# Altium project running car pcb.PrjPcb
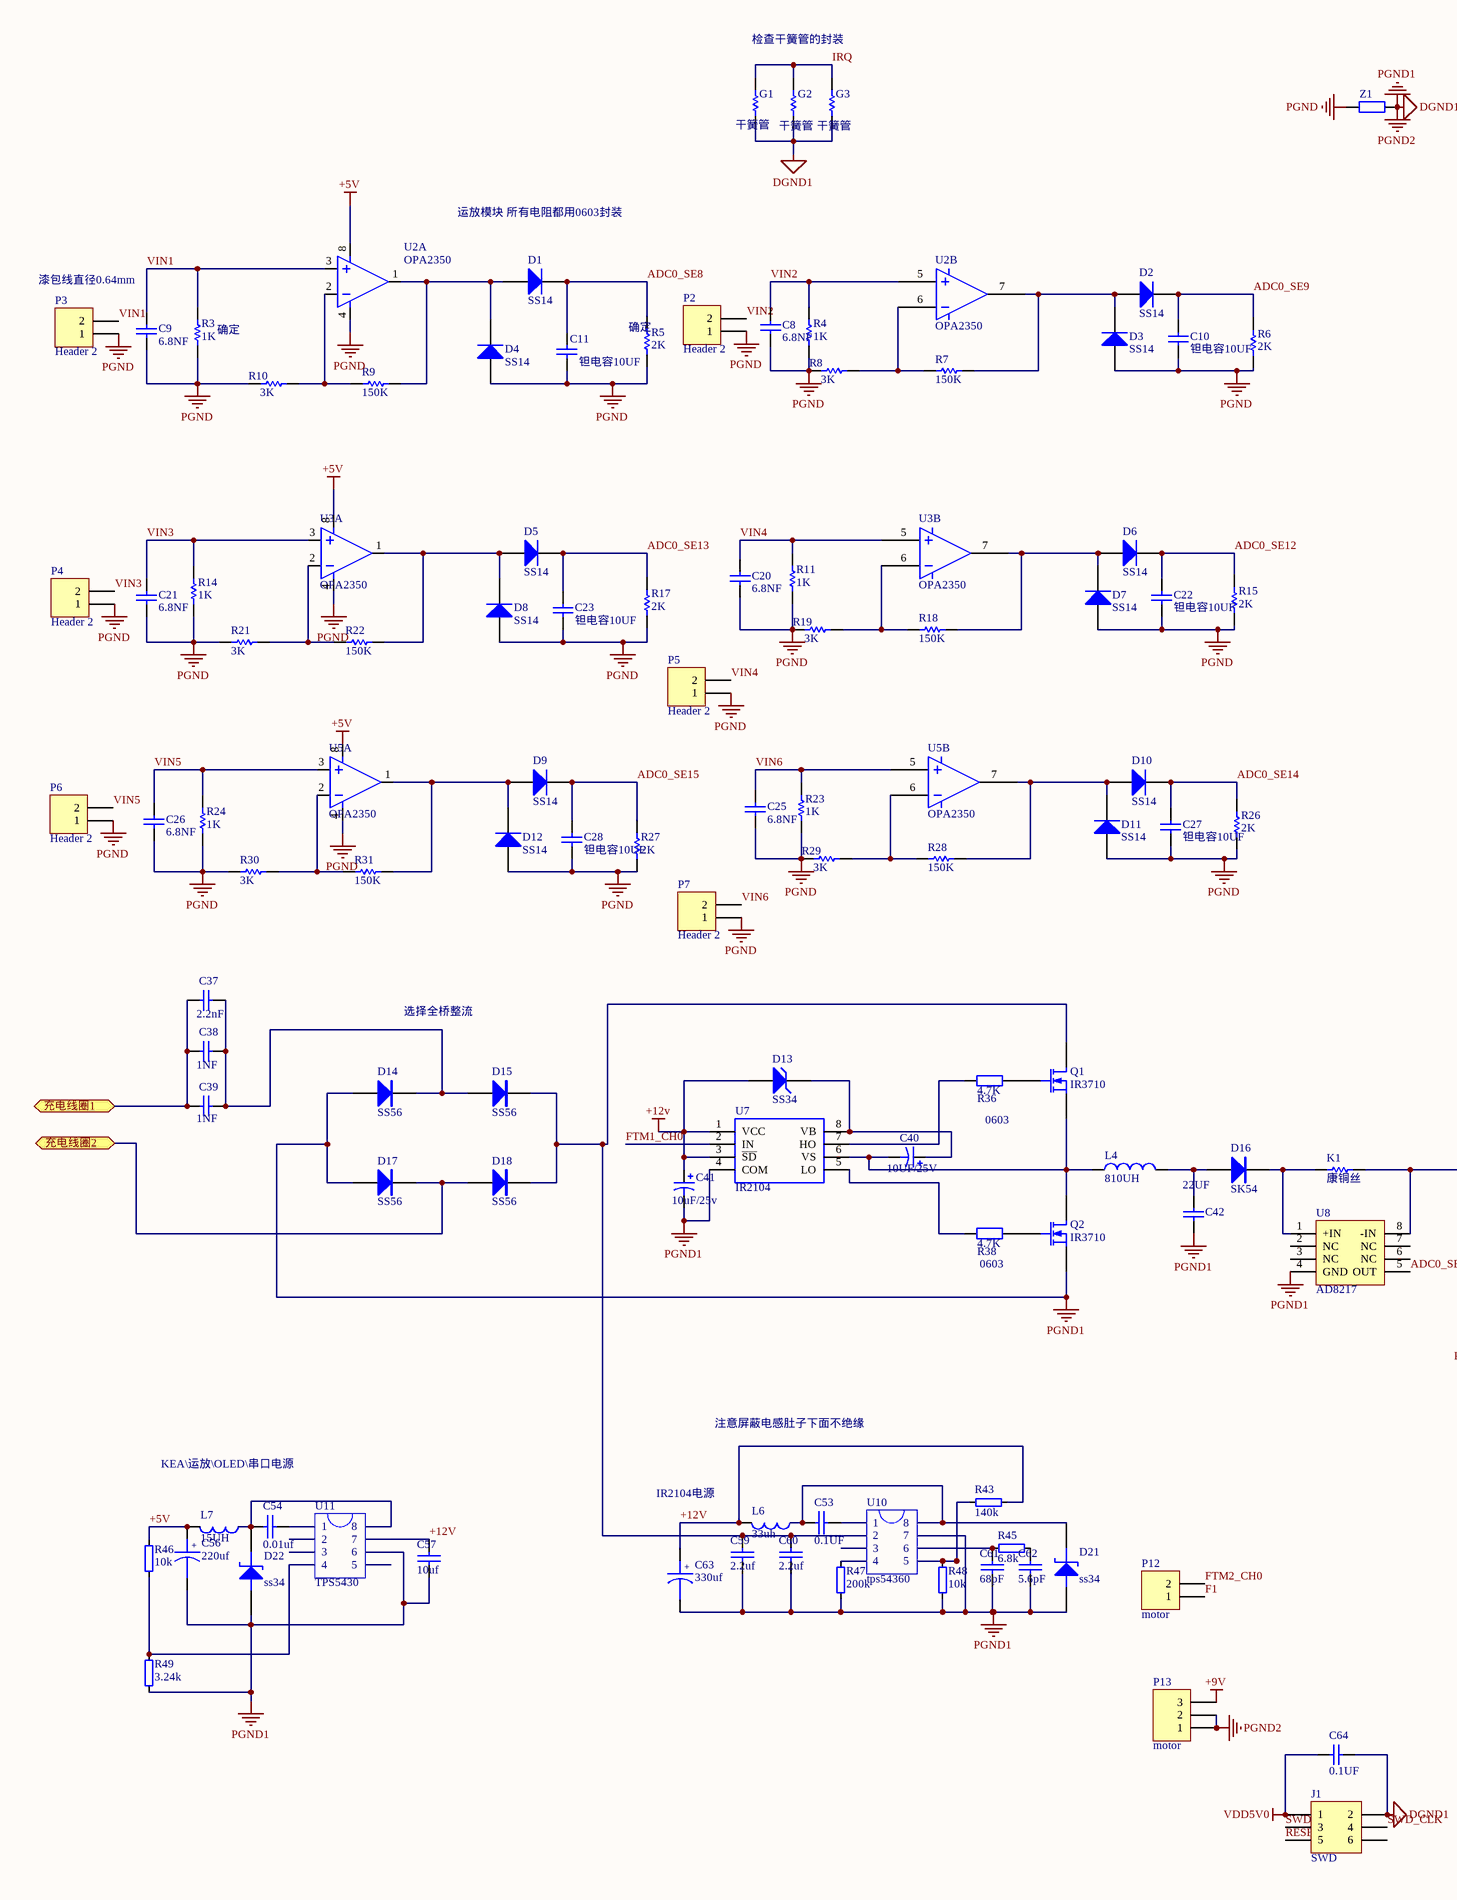
[diagram p0: running car pcb.SchDoc, left]
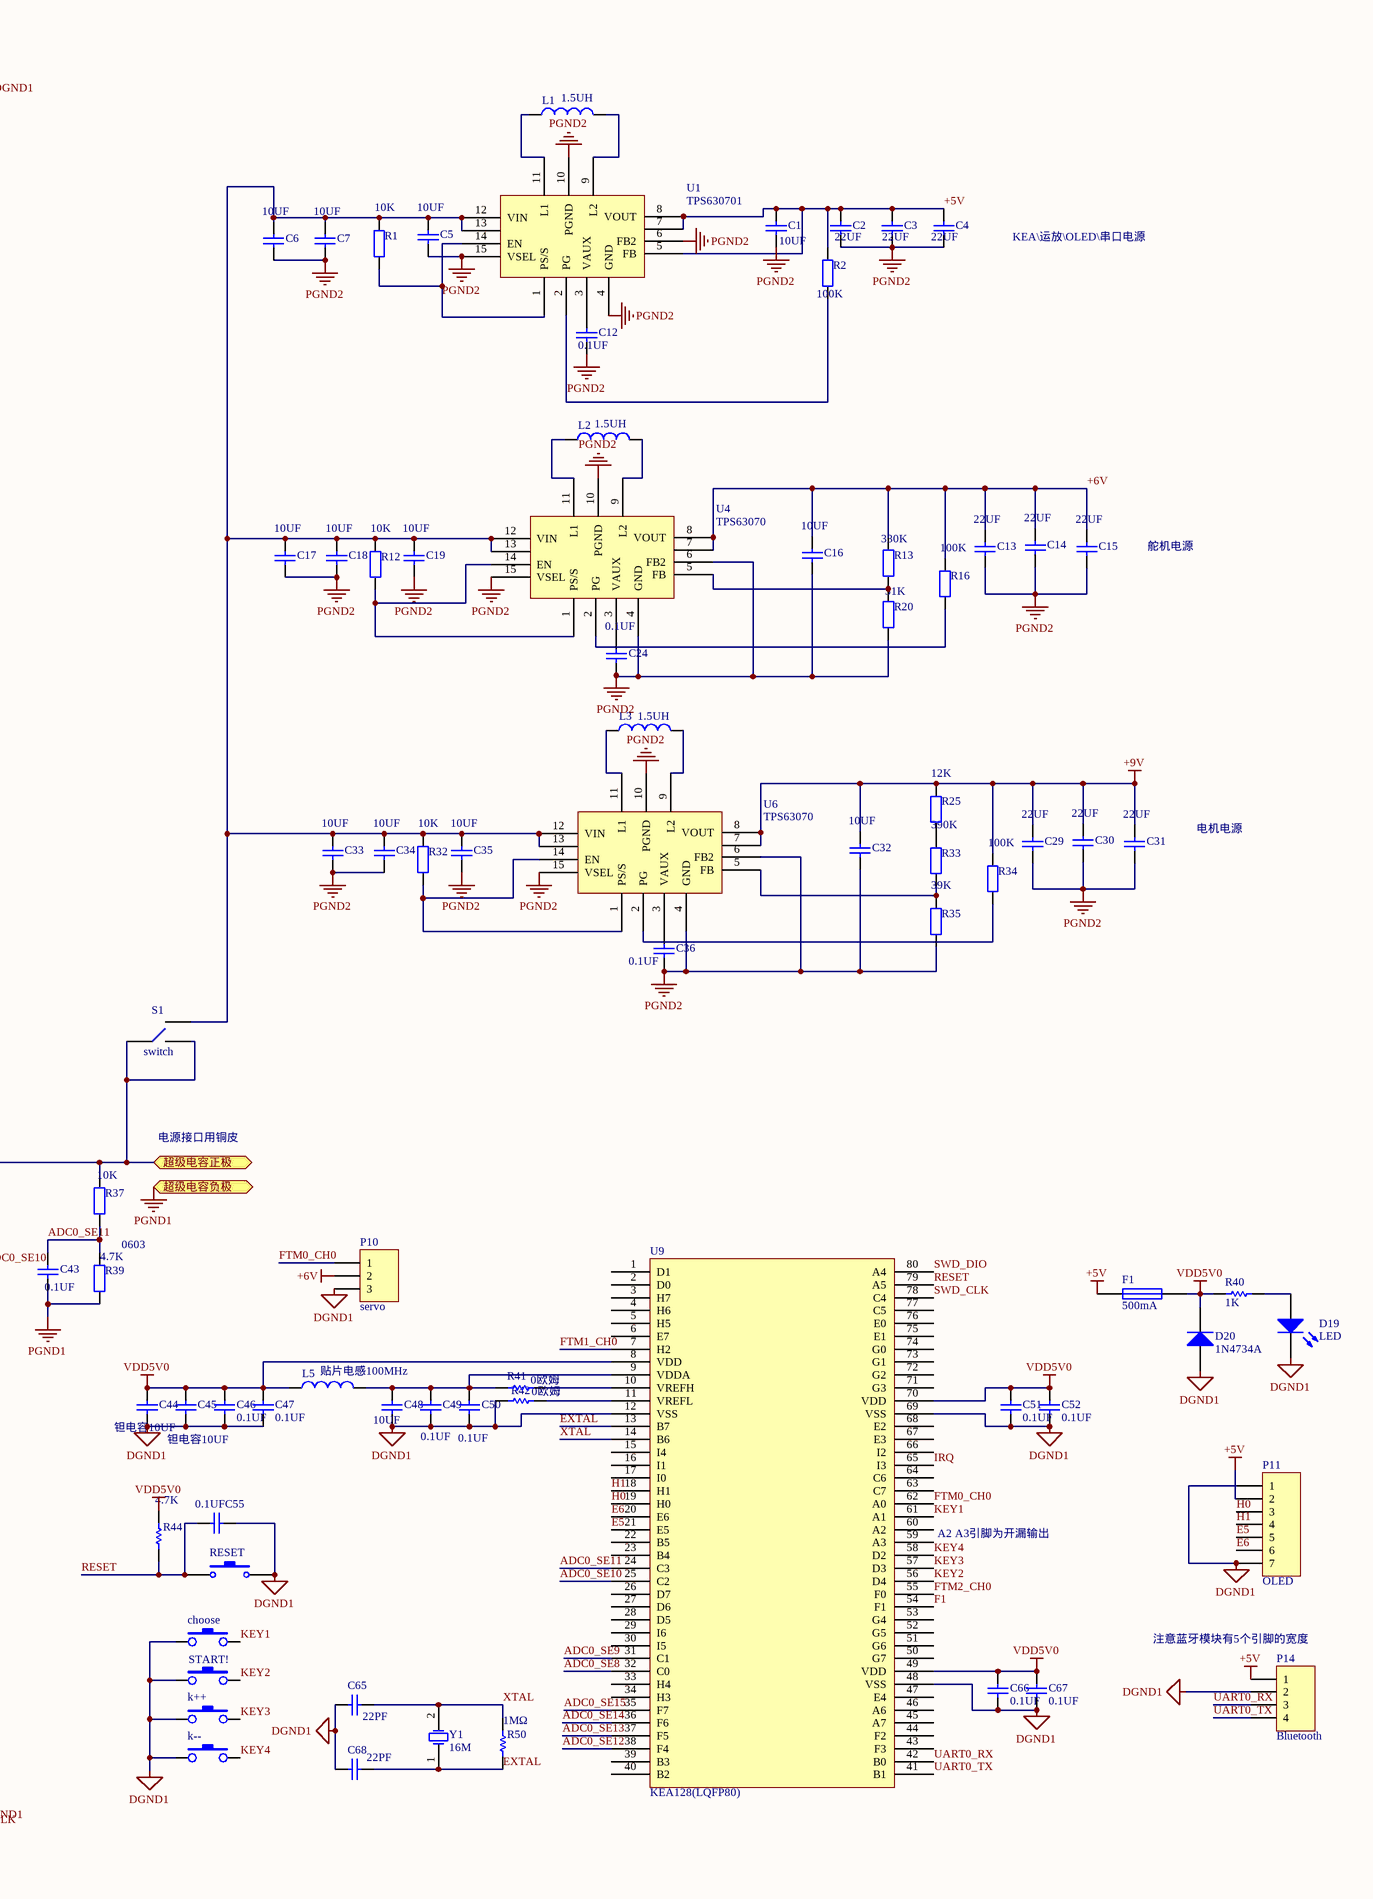
[diagram p1: running car pcb.SchDoc, right]
1 sheet, 184 parts. Net scope: flat (ports and power ports of the same name join across sheets).
Board file: running car pcb.PcbDoc

## Sheet running car pcb.SchDoc
size A2

### Parts
C1  10UF  [C0805]
C2  22UF  [C0805]
C3  22UF  [C0805]
C4  22UF  [C0805]
C5  10UF  [C0805]
C6  10UF  [C0805]
C7  10UF  [C0805]
C8  6.8NF  [6.8NF]
C9  6.8NF  [6.8NF]
C10  钽电容10UF  [106A]
C11  钽电容10UF  [106A]
C12  0.1UF  [1608[0603]]
C13  22UF  [C0805]
C14  22UF  [C0805]
C15  22UF  [C0805]
C16  10UF  [C0805]
C17  10UF  [C0805]
C18  10UF  [C0805]
C19  10UF  [C0805]
C20  6.8NF  [6.8NF]
C21  6.8NF  [6.8NF]
C22  钽电容10UF  [106A]
C23  钽电容10UF  [106A]
C24  0.1UF  [1608[0603]]
C25  6.8NF  [6.8NF]
C26  6.8NF  [6.8NF]
C27  钽电容10UF  [106A]
C28  钽电容10UF  [106A]
C29  22UF  [C0805]
C30  22UF  [C0805]
C31  22UF  [C0805]
C32  10UF  [C0805]
C33  10UF  [C0805]
C34  10UF  [C0805]
C35  10UF  [C0805]
C36  0.1UF  [1608[0603]]
C37  2.2nF  [C1206]
C38  1NF  [C1206]
C39  1NF  [C1206]
C40  10UF/25V  [CAP_3528]
C41  10UF/25V  [CAP_3528]
C42  22UF  [C0805]
C43  0.1UF  [1608[0603]]
C44  钽电容10UF  [106A]
C45  钽电容10UF  [106A]
C46  0.1UF  [1608[0603]]
C47  0.1UF  [1608[0603]]
C48  10UF  [C0805]
C49  0.1UF  [1608[0603]]
C50  0.1UF  [1608[0603]]
C51  0.1UF  [1608[0603]]
C52  0.1UF  [1608[0603]]
C53  0.1UF  [1608[0603]]
C54  0.01uf  [1608[0603]]
C55  0.1UF  [1608[0603]]
C56  220uf  [SMD-EC-F6.3]
C57  10uf  [C0805]
C59  2.2uf  [C0805]
C60  2.2uf  [C0805]
C61  68pF  [1608[0603]]
C62  5.6pF  [1608[0603]]
C63  330uf  [SMD-EC-F8]
C64  0.1UF  [1608[0603]]
C65  22PF  [1608[0603]]
C66  0.1UF  [1608[0603]]
C67  0.1UF  [1608[0603]]
C68  22PF  [1608[0603]]
choose  按键  [KEY2(TP_S)]  (value not drawn)
D1  SS14  [SS14]
D2  SS14  [SS14]
D3  SS14  [SS14]
D4  SS14  [SS14]
D5  SS14  [SS14]
D6  SS14  [ss14]
D7  SS14  [ss14]
D8  SS14  [SS14]
D9  SS14  [ss14]
D10  SS14  [ss14]
D11  SS14  [ss14]
D12  SS14  [ss14]
D13  SS34  [SS14]
D14  SS56  [SS14]
D15  SS56  [SS14]
D16  SK54  [SMB]
D17  SS56  [SS14]
D18  SS56  [SS14]
D19  LED  [0603D]
D20  1N4734A  [1N4734A]
D21  ss34  [SS14]
D22  ss34  [SS14]
F1  500mA  [F1]
G1  干簧管  [干簧管]
G2  干簧管  [干簧管]
G3  干簧管  [干簧管]
J1  SWD  [HDR2X3]
K1  康铜丝  [KTS]
k++  按键  [KEY2(TP_S)]  (value not drawn)
k--  按键  [KEY2(TP_S)]  (value not drawn)
L1  1.5UH  [1.5UH]
L2  1.5UH  [1.5UH]
L3  1.5UH  [1.5UH]
L4  810UH  [810UH]
L5  贴片电感100MHz  [6-0805_L]
L6  33uh  [SLF101]
L7  15UH  [SLF70]
P2  Header 2  [漆包线0.64mm]
P3  Header 2  [漆包线0.64mm]
P4  Header 2  [漆包线0.64mm]
P5  Header 2  [漆包线0.64mm]
P6  Header 2  [漆包线0.64mm]
P7  Header 2  [漆包线0.64mm]
P10  servo  [HDR1X3]
P11  OLED  [HDR1X7]
P12  motor  [HDR1X2]
P13  motor  [HDR1X3]
P14  Bluetooth  [HDR1X4]
Q1  IR3710  [NMOS]
Q2  IR3710  [NMOS]
R1  10K  [1608[0603]]
R2  100K  [1608[0603]]
R3  1K  [1608[0603]]
R4  1K  [1608[0603]]
R5  2K  [1608[0603]]
R6  2K  [1608[0603]]
R7  150K  [1608[0603]]
R8  3K  [1608[0603]]
R9  150K  [1608[0603]]
R10  3K  [1608[0603]]
R11  1K  [1608[0603]]
R12  10K  [1608[0603]]
R13  330K  [1608[0603]]
R14  1K  [1608[0603]]
R15  2K  [1608[0603]]
R16  100K  [1608[0603]]
R17  2K  [1608[0603]]
R18  150K  [1608[0603]]
R19  3K  [1608[0603]]
R20  51K  [1608[0603]]
R21  3K  [1608[0603]]
R22  150K  [1608[0603]]
R23  1K  [1608[0603]]
R24  1K  [1608[0603]]
R25  12K  [1608[0603]]
R26  2K  [1608[0603]]
R27  2K  [1608[0603]]
R28  150K  [1608[0603]]
R29  3K  [1608[0603]]
R30  3K  [1608[0603]]
R31  150K  [1608[0603]]
R32  10K  [1608[0603]]
R33  390K  [1608[0603]]
R34  100K  [1608[0603]]
R35  39K  [1608[0603]]
R36  4.7K  [1608[0603]]
R37  10K  [1608[0603]]
R38  4.7K  [1608[0603]]
R39  4.7K  [1608[0603]]
R40  1K  [1608[0603]]
R41  0欧姆  [1608[0603]]
R42  0欧姆  [1608[0603]]
R43  140k  [1608[0603]]
R44  4.7K  [1608[0603]]
R45  6.8k  [1608[0603]]
R46  10k  [1608[0603]]
R47  200k  [1608[0603]]
R48  10k  [1608[0603]]
R49  3.24k  [1608[0603]]
R50  1MΩ  [1608[0603]]
RESET  按键  [KEY2(TP_S)]  (value not drawn)
S1  switch  [扭头开关]
START!  按键  [KEY2(TP_S)]  (value not drawn)
U1  TPS630701  [LQ_VQFN15]
U2  OPA2350  [SOP_8]  (parts A,B of 2)
U3  OPA2350  [SOP_8]  (parts A,B of 2)
U4  TPS63070  [LQ_VQFN15]
U5  OPA2350  [SOP_8]  (parts A,B of 2)
U6  TPS63070  [LQ_VQFN15]
U7  IR2104  [SOP_8]
U8  AD8217  [RM-8]
U9  KEA128(LQFP80)  [LQFP80]
U10  tps54360  [SOP_8]
U11  TPS5430  [SOP_8]
Y1  16M  [16M]
Z1  0欧姆  [C0805]  (value not drawn)

### Ports
充电线圈1, 充电线圈2, 超级电容正极, 超级电容负极

### Nets
+5V: C1.1 C2.1 C3.1 C4.1 C56.1 F1.1 L7.1 P11.2 P14.1 R2.1 R46.2 U1.5(FB) U1.7 U1.8(VOUT) U2.8 U3.8 U5.8
+6V: C13.1 C14.1 C15.1 C16.1 P10.2 R13.1 R16.1 U4.7 U4.8(VOUT)
+9V: C29.1 C30.1 C31.1 C32.1 P13.3 R25.1 R34.1 U6.7 U6.8(VOUT)
+12V: C41.1 C57.1 C63.1 D13.1(A) L6.1 R43.1 U7.1(VCC) U7.3(~{SD}) U11.7
DGND1: C1.2 C2.2 C3.2 C4.2 C5.2 C6.2 C7.2 C12.2 C13.2 C14.2 C15.2 C16.2 C17.2 C18.2 C19.2 C24.2 C29.2 C30.2 C31.2 C32.2 C33.2 C34.2 C35.2 C36.2 C41.2 C42.2 C43.2 C44.1 C45.1 C46.1 C47.1 C48.1 C49.1 C50.1 C51.1 C52.1 C55.1 C56.2 C57.2 C59.2 C60.2 C61.2 C62.2 C63.2 C64.1 C65.2 C66.1 C67.1 C68.2 choose.1 D14.A D17.A D19.2(K) D20.1(A) D21.1(A) D22.1(A) G1.1 G2.1 G3.1 J1.2 k++.1 k--.1 P10.3 P11.1 P11.7 P13.1 P13.2 P14.2 Q2.3(S) R20.2 R35.2 R39.2 R42.1 R47.1 R48.1 R49.1 RESET.2 START!.1 U1.4(GND) U1.6(FB2) U1.10(PGND) U1.15(VSEL) U4.4(GND) U4.6(FB2) U4.10(PGND) U4.15(VSEL) U6.4(GND) U6.6(FB2) U6.10(PGND) U6.15(VSEL) U7.4(COM) U8.4(GND) U9.12(VSS) U9.48(VSS) U9.69(VSS) U10.7 U11.6 Z1.1 ; port 超级电容负极  [also labelled PGND1, PGND2]
PGND: C8.1 C9.1 C10.1 C11.1 C20.1 C21.1 C22.1 C23.1 C25.1 C26.1 C27.1 C28.1 D3.1(A) D4.1(A) D7.1(A) D8.1(A) D11.1(A) D12.1(A) P2.1 P3.1 P4.1 P5.1 P6.1 P7.1 R3.1 R4.1 R5.1 R6.1 R8.1 R10.1 R11.1 R14.1 R15.1 R17.1 R19.1 R21.1 R23.1 R24.1 R26.1 R27.1 R29.1 R30.1 U2.4 U3.4 U5.4 Z1.2
VDD5V0: C44.2 C45.2 C46.2 C47.2 C51.2 C52.2 C64.2 C66.2 C67.2 D20.2(K) F1.2 J1.1 L5.1 R40.1 R44.2 U9.8(VDD) U9.49(VDD) U9.70(VDD)
ADC0_SE8: C11.2 D1.2(K) R5.2 U9.32(C0)
ADC0_SE9: C10.2 D2.2(K) R6.2 U9.31(C1)
ADC0_SE10: U8.5(OUT) U9.25(C2)
ADC0_SE11: C43.1 R37.2 R39.1 U9.24(C3)
ADC0_SE12: C22.2 D6.2(K) R15.2 U9.38(F4)
ADC0_SE13: C23.2 D5.2(K) R17.2 U9.37(F5)
ADC0_SE14: C27.2 D10.2(K) R26.2 U9.36(F6)
ADC0_SE15: C28.2 D9.2(K) R27.2 U9.35(F7)
E5: P11.5 U9.21(E5)
E6: P11.6 U9.20(E6)
EXTAL: C68.1 R50.1 U9.13(B7) Y1.1(OSC1)
F1: P12.1 U9.54(F1)
FTM0_CH0: P10.1 U9.62(A0)
FTM1_CH0: U7.2(IN) U9.7(H2)
FTM2_CH0: P12.2 U9.55(F0)
H0: P11.3 U9.19(H0)
H1: P11.4 U9.18(H1)
IRQ: G1.2 G2.2 G3.2 U9.65(I3)
KEY1: choose.2 U9.61(A1)
KEY2: START!.2 U9.56(D4)
KEY3: k++.2 U9.57(D3)
KEY4: k--.2 U9.58(D2)
RESET: C55.2 J1.5 R44.1 RESET.1 U9.79(A5)
SWD_CLK: J1.4 U9.78(C4)
SWD_DIO: J1.3 U9.80(A4)
UART0_RX: P14.3 U9.42(B0)
UART0_TX: P14.4 U9.41(B1)
VIN1: C9.2 P3.2 R3.2 U2.3
VIN2: C8.2 P2.2 R4.2 U2.5
VIN3: C21.2 P4.2 R14.2 U3.3
VIN4: C20.2 P5.2 R11.2 U3.5
VIN5: C26.2 P6.2 R24.2 U5.3
VIN6: C25.2 P7.2 R23.2 U5.5
XTAL: C65.1 R50.2 U9.14(B6) Y1.2(OSC2)
NetC5_1: C5.1 C6.1 C7.1 C17.1 C18.1 C19.1 C33.1 C34.1 C35.1 R1.1 R12.1 R32.1 S1.2 U1.12(VIN) U1.13 U4.12(VIN) U4.13 U6.12(VIN) U6.13
NetC12_1: C12.1 U1.3(VAUX)
NetC24_1: C24.1 U4.3(VAUX)
NetC36_1: C36.1 U6.3(VAUX)
NetC37_1: C37.1 C38.1 C39.1 D14.K D15.A
NetC37_2: C37.2 C38.2 C39.2 ; port 充电线圈1
NetC40_1: C40.1 D13.2(K) U7.8(VB)
NetC40_2: C40.2 L4.1 Q1.3(S) Q2.2(D) U7.6(VS)
NetC42_1: C42.1 D16.A L4.2
NetC48_2: C48.2 C49.2 C50.2 L5.2 R41.1 U9.9(VDDA)
NetC53_1: C53.1 D21.2(K) L6.2 U10.8
NetC53_2: C53.2 U10.1
NetC54_1: C54.1 D22.2(K) L7.2 U11.8
NetC54_2: C54.2 U11.1
NetC59_1: C59.1 C60.1 D15.K D18.K Q1.2(D) U10.2
NetC61_1: C61.1 R45.2 U10.6
NetC62_1: C62.1 R45.1
NetD1_1: D1.1(A) D4.2(K) R9.2 U2.1
NetD2_1: D2.1(A) D3.2(K) R7.2 U2.7
NetD5_1: D5.1(A) D8.2(K) R22.2 U3.1
NetD6_1: D6.1(A) D7.2(K) R18.2 U3.7
NetD9_1: D9.1(A) D12.2(K) R31.2 U5.1
NetD10_1: D10.1(A) D11.2(K) R28.2 U5.7
NetD16_K: D16.K K1.1 U8.1(+IN)
NetD17_K: D17.K D18.A ; port 充电线圈2
NetD19_1: D19.1(A) R40.2
NetK1_2: K1.2 R37.1 S1.1 S1.3 U8.8(-IN) ; port 超级电容正极
NetL1_1: L1.1 U1.11(L1)
NetL1_2: L1.2 U1.9(L2)
NetL2_1: L2.1 U4.11(L1)
NetL2_2: L2.2 U4.9(L2)
NetL3_1: L3.1 U6.11(L1)
NetL3_2: L3.2 U6.9(L2)
NetQ1_1: Q1.1(G) R36.2
NetQ2_1: Q2.1(G) R38.2
NetR1_2: R1.2 U1.1(PS/S) U1.14(EN)
NetR2_2: R2.2 U1.2(PG)
NetR7_1: R7.1 R8.2 U2.6
NetR9_1: R9.1 R10.2 U2.2
NetR12_2: R12.2 U4.1(PS/S) U4.14(EN)
NetR13_2: R13.2 R20.1 U4.5(FB)
NetR16_2: R16.2 U4.2(PG)
NetR18_1: R18.1 R19.2 U3.6
NetR21_2: R21.2 R22.1 U3.2
NetR25_2: R25.2 R33.1
NetR28_1: R28.1 R29.2 U5.6
NetR30_2: R30.2 R31.1 U5.2
NetR32_2: R32.2 U6.1(PS/S) U6.14(EN)
NetR33_2: R33.2 R35.1 U6.5(FB)
NetR34_2: R34.2 U6.2(PG)
NetR36_1: R36.1 U7.7(HO)
NetR38_1: R38.1 U7.5(LO)
NetR41_2: R41.2 U9.10(VREFH)
NetR42_2: R42.2 U9.11(VREFL)
NetR43_2: R43.2 R48.2 U10.5
NetR46_1: R46.1 R49.2 U11.4
NetR47_2: R47.2 U10.4

Not connected (* = marked no-connect by the designer): J1 6; U8 2(NC) 3(NC) 6(NC) 7(NC); U9 1(D1) 2(D0) 3(H7) 4(H6) 5(H5) 6(E7) 15(I4) 16(I1) 17(I0) 22(B5) 23(B4) 26(D7) 27(D6) 28(D5) 29(I6) 30(I5) 33(H4) 34(H3) 39(B3) 40(B2) 43(F3) 44(F2) 45(A7) 46(A6) 47(E4) 50(G7) 51(G6) 52(G5) 53(G4) 59(A3) 60(A2) 63(C7) 64(C6) 66(I2) 67(E3) 68(E2) 71(G3) 72(G2) 73(G1) 74(G0) 75(E1) 76(E0) 77(C5); U10 3; U11 2 3 5

### Notes on the sheet
- 检查干簧管的封装
- 运放模块 所有电阻都用0603封装
- (near P3) 漆包线直径0.64mm
- KEA\运放\OLED\串口电源
- (near R3) 确定
- (near R5) 确定
- 舵机电源
- 电机电源
- 选择全桥整流
- 0603
- 电源接口用铜皮
- 注意屏蔽电感肚子下面不绝缘
- IR2104电源
- (near U9) A2 A3引脚为开漏输出
- 注意蓝牙模块有5个引脚的宽度
- (in symbol 电解电容) +

### Library data of the parts
C1-C9 C13-C21 C25 C26 C29-C35 C37-C39 C42 C43 C46-C52 C55 C64-C68 = Cap: Capacitor; Published: 8-Jun-2000; LatestRevisionDate: 17-Jul-2002; LatestRevisionNote: Re-released for DXP Platform.; PackageReference: RAD-0.3; Publisher: Altium Limited; PackageDescription: Radial Cap, Thru-Hole; 2 Leads; 0.3 in Pin Spacing
  C1 C5-C7 C16-C19 C32-C35 C48: Value: 10uF
  C2-C4 C13-C15 C29-C31 C42: Value: 22uF
  C8 C9 C20 C25 C26: Value: 6.8nf
  C37: Value: 2.2nF
  C38 C39: Value: 1nF
  C43: Value: 0.1uf
  C46 C47 C49-C52 C55 C64 C66 C67: Value: 0.1uF
  C65 C68: Value: 22pF
C10 C11 C22 C23 C27 C28 = Cap: Capacitor; Value: 10UF; Published: 8-Jun-2000; LatestRevisionDate: 17-Jul-2002; LatestRevisionNote: Re-released for DXP Platform.; PackageReference: RAD-0.3; Publisher: Altium Limited; PackageDescription: Radial Cap, Thru-Hole; 2 Leads; 0.3 in Pin Spacing
C12 C24 C36 = Cap: Capacitor; Value: 100nF; Published: 8-Jun-2000; LatestRevisionDate: 17-Jul-2002; LatestRevisionNote: Re-released for DXP Platform.; PackageReference: RAD-0.3; Publisher: Altium Limited; PackageDescription: Radial Cap, Thru-Hole; 2 Leads; 0.3 in Pin Spacing
C40 C41 = C2: Capacitor; Value: 10uF/25v
C44 C45 = Cap: Capacitor; Value: 106A; Published: 8-Jun-2000; LatestRevisionDate: 17-Jul-2002; LatestRevisionNote: Re-released for DXP Platform.; PackageReference: RAD-0.3; Publisher: Altium Limited; PackageDescription: Radial Cap, Thru-Hole; 2 Leads; 0.3 in Pin Spacing
C53 C54 C57 C59-C62 = 普通电容: Capacitor
C56 = 电解电容: Capacitor/16V
C63 = 电解电容: Capacitor/25V
choose k++ k-- START! = KEY
D1 D2 D5 D6 D9 D10 = Diode: Default Diode; Published: 8-Jun-2000; LatestRevisionDate: 17-Jul-2002; LatestRevisionNote: Re-released for DXP Platform.; PackageVersion: Sep-1996; PackageReference: SMC; Publisher: Altium Limited; PackageDescription: DO-214-AB/SMC; 2 C-Bend Leads; Body 7.9 x 5.9 mm, inc. leads (LxW); Code_JEDEC: DO-214-AB
D3 D4 D7 D8 D11 D12 = Diode 1N4001: 1 Amp General Purpose Rectifier; Published: 8-Jun-2000; LatestRevisionDate: 17-Jul-2002; LatestRevisionNote: Re-released for DXP Platform.; DatasheetVersion: 1998; PackageVersion: Aug-1999; PackageReference: DO-41; Publisher: Altium Limited; PackageDescription: Diode, Axial; Body 5.2 x 2.7 mm (LxDia. max), Lead Dia. 0.86 mm (max); Code_JEDEC: DO-204-AL; ComponentLink1Description: Manufacturer Link; ComponentLink1URL: http://www.fairchildsemi.com/; ComponentLink2Description: Datasheet; ComponentLink2URL: http://www.fairchildsemi.com/ds/1N%2F1N4001.pdf
D13 = D1_1N5822
D14-D18 = DIODE: pin to pad: A>1 K>2
D19 = LED3: Typical BLUE SiC LED; Published: 8-Jun-2000; LatestRevisionDate: 17-Dec-2003; LatestRevisionNote: PCB Footprint replaced.; DatasheetVersion: 16-Apr-2002; PackageVersion: 16-Apr-2002; PackageReference: 3.5X2.8X1.9; Publisher: Altium Limited; PackageDescription: SM LED; 2 C-Bend Leads; Body 3.5 x 2.8 x 1.9 mm, inc leads (LxWxH typ)
D20 = Diode 1N5408: 3 Amp Medium Power Silicon Rectifier Diode; Published: 8-Jun-2000; LatestRevisionDate: 17-Jul-2002; LatestRevisionNote: Re-released for DXP Platform.; DatasheetVersion: Aug-1984; PackageReference: DO-201AD; Publisher: Altium Limited; PackageDescription: Diode, Axial; Body 9.5 x 5.3 mm (LxDia. max), Lead Dia. 1.32 mm (max); ComponentLink1Description: Manufacturer Link; ComponentLink1URL: http://www.irf.com/
D21 D22 = ZENER2: Zener Diode
F1 = Fuse 1: Fuse; Published: 8-Jun-2000; LatestRevisionDate: 17-Jul-2002; LatestRevisionNote: Re-released for DXP Platform.; PackageReference: PIN-W2/E2.8; Publisher: Altium Limited; PackageDescription: Thru-Hole; 2 Leads; value: 500mA
G1-G3 K1 R7 R8 R18 R19 R21 R22 R28-R31 = Res1: Resistor; Value: 1K; Published: 8-Jun-2000; LatestRevisionDate: 17-Jul-2002; LatestRevisionNote: Re-released for DXP Platform.; PackageReference: AXIAL-0.3; Publisher: Altium Limited; PackageDescription: Axial Device, Thru-Hole; 2 Leads; 0.3 in Pin Spacing
J1 = Header 3X2: Header, 3-Pin, Dual row; LatestRevisionDate: 17-Jul-2002; LatestRevisionNote: Re-released for DXP Platform.; Publisher: Altium Limited
L1-L4 = Inductor: Code_IEC: 1005; Published: 8-Jun-2000; LatestRevisionDate: 17-Jul-2002; LatestRevisionNote: Re-released for DXP Platform.; PackageReference: 0402-A; Publisher: Altium Limited; Code_JEITA: 0402
  L1-L3: Value: 1.5uH
  L4: Value: 810UH
L5 = Inductor: Code_IEC: 1005; Value: 100MHz; Published: 8-Jun-2000; LatestRevisionDate: 29-May-2009; LatestRevisionNote: IPC-7351 Footprint Added.; PackageReference: 0402-A; Publisher: Altium Limited; PackageDescription: Chip Inductor; Code_JEITA: 0402
L6 L7 = L
P2-P7 P12 = Header 2: Header, 2-Pin; LatestRevisionDate: 17-Jul-2002; LatestRevisionNote: Re-released for DXP Platform.; Publisher: Altium Limited
P10 P13 = Header 3: Header, 3-Pin; LatestRevisionDate: 17-Jul-2002; LatestRevisionNote: Re-released for DXP Platform.; Publisher: Altium Limited
P11 = Header 7: Header, 7-Pin; LatestRevisionDate: 17-Jul-2002; LatestRevisionNote: Re-released for DXP Platform.; Publisher: Altium Limited
P14 = Header 4: Header, 4-Pin; LatestRevisionDate: 17-Jul-2002; LatestRevisionNote: Re-released for DXP Platform.; Publisher: Altium Limited
Q1 Q2 = MOSFET-N: N-Channel MOSFET; PackageDocument: 1995/1996; Published: 8-Jun-2000; LatestRevisionDate: 17-Jul-2002; LatestRevisionNote: Re-released for DXP Platform.; PackageReference: E3; Publisher: Altium Limited
R1 R2 R12 R13 R16 R20 R25 R32-R35 R37 R39 = Res2: Resistor; Published: 8-Jun-2000; LatestRevisionDate: 17-Jul-2002; LatestRevisionNote: Re-released for DXP Platform.; PackageReference: 1608[0603]; Publisher: Altium Limited
  R1 R12 R32 R37: Value: 10K
  R2 R16 R34: Value: 100K
  R13: Value: 330K
  R20: Value: 51K
  R25: Value: 12K
  R33: Value: 390K
  R35: Value: 39K
  R39: Value: 4.7K
R3-R6 R9-R11 R14 R15 R17 R23 R24 R26 R27 = Res1: Resistor; Published: 8-Jun-2000; LatestRevisionDate: 17-Jul-2002; LatestRevisionNote: Re-released for DXP Platform.; PackageReference: AXIAL-0.3; Publisher: Altium Limited; PackageDescription: Axial Device, Thru-Hole; 2 Leads; 0.3 in Pin Spacing
  R3 R4 R11 R23: Value: 1K
  R5 R6 R15 R17 R26 R27: Value: 2K
R36 R38 = Res2: Resistor; Value: 4K7; Published: 8-Jun-2000; LatestRevisionDate: 17-Jul-2002; LatestRevisionNote: Re-released for DXP Platform.; PackageReference: 1608[0603]; Publisher: Altium Limited
R40 R44 = Res Semi: Semiconductor Resistor; Published: 8-Jun-2000; LatestRevisionDate: 17-Jul-2002; LatestRevisionNote: Re-released for DXP Platform.; PackageReference: AXIAL-0.5; Publisher: Altium Limited; PackageDescription: Axial Device, Thru-Hole; 2 Leads; 0.5 in Pin Spacing
  R40: Value: 1k
  R44: Value: 4.7k
R41 R42 = Res Semi: Semiconductor Resistor; Value: 0Ω; Published: 8-Jun-2000; LatestRevisionDate: 17-Jul-2002; LatestRevisionNote: Re-released for DXP Platform.; PackageReference: AXIAL-0.5; Publisher: Altium Limited; PackageDescription: Axial Device, Thru-Hole; 2 Leads; 0.5 in Pin Spacing
R43 R45-R49 = RES
R50 = Res Semi: Semiconductor Resistor; Value: 1M; Published: 8-Jun-2000; LatestRevisionDate: 17-Jul-2002; LatestRevisionNote: Re-released for DXP Platform.; PackageReference: AXIAL-0.5; Publisher: Altium Limited; PackageDescription: Axial Device, Thru-Hole; 2 Leads; 0.5 in Pin Spacing
RESET = SW-PB: Switch; Published: 24-Mar-1999; LatestRevisionDate: 17-Jul-2002; LatestRevisionNote: Re-released for DXP Platform.; PackageReference: SPST-2; Publisher: Altium Limited; PackageDescription: Switch; 2 Leads
S1 = slide_switch
U1 U4 U6 = TPS63070(1)
U2 U3 U5 = LM193
U10 U11 = 8PIN
Y1 = XTAL: Crystal Oscillator; Published: 8-Jun-2000; LatestRevisionDate: 17-Jul-2002; LatestRevisionNote: Re-released for DXP Platform.; PackageReference: R38; Publisher: Altium Limited; PackageDescription: Crystal, Thru-Hole; 2 Leads; Body 3.1 x 8.2 mm (Dia.xH); value: 16M
Z1 = Res2: Resistor; Value: 0; Published: 8-Jun-2000; LatestRevisionDate: 17-Jul-2002; LatestRevisionNote: Re-released for DXP Platform.; PackageReference: AXIAL-0.4; Publisher: Altium Limited; PackageDescription: Axial Device, Thru-Hole; 2 Leads; 0.4 in Pin Spacing